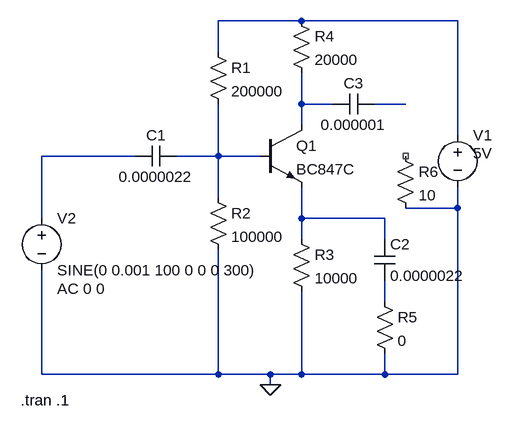
[diagram p0: schematic Wechselspannungsverstärker.asc]
Wechselspannungsverstärker.asc, the LTspice schematic file:
Version 4
SHEET 1 880 680
WIRE 224 -304 96 -304
WIRE 464 -304 224 -304
WIRE 96 -256 96 -304
WIRE 224 -176 224 -224
WIRE 272 -176 224 -176
WIRE 384 -176 336 -176
WIRE 224 -144 224 -176
WIRE 464 -128 464 -304
WIRE -32 -96 -176 -96
WIRE 96 -96 96 -176
WIRE 96 -96 32 -96
WIRE 160 -96 96 -96
WIRE 96 -32 96 -96
WIRE 464 -16 464 -48
WIRE 464 -16 384 -16
WIRE -176 0 -176 -96
WIRE 224 0 224 -48
WIRE 352 0 224 0
WIRE 224 32 224 0
WIRE 352 32 352 0
WIRE 352 128 352 96
WIRE -176 240 -176 80
WIRE 96 240 96 48
WIRE 96 240 -176 240
WIRE 176 240 96 240
WIRE 224 240 224 112
WIRE 224 240 176 240
WIRE 352 240 352 208
WIRE 352 240 224 240
WIRE 464 240 464 -16
WIRE 464 240 352 240
WIRE 176 256 176 240
FLAG 176 256 0
DATAFLAG 400 -304 ""
DATAFLAG 256 -176 ""
DATAFLAG 144 -96 ""
DATAFLAG 224 -32 ""
SYMBOL npn 160 -144 R0
SYMATTR InstName Q1
SYMATTR Value BC847C
SYMBOL res 80 -272 R0
SYMATTR InstName R1
SYMATTR Value 200000
SYMBOL res 80 -48 R0
SYMATTR InstName R2
SYMATTR Value 100000
SYMBOL res 208 16 R0
SYMATTR InstName R3
SYMATTR Value 10000
SYMBOL cap 32 -112 R90
WINDOW 0 0 32 VBottom 2
WINDOW 3 32 32 VTop 2
SYMATTR InstName C1
SYMATTR Value 0.0000022
SYMBOL voltage 464 -144 R0
WINDOW 3 24 44 Left 2
WINDOW 123 0 0 Left 0
WINDOW 39 0 0 Left 0
SYMATTR Value 5V
SYMATTR InstName V1
SYMBOL voltage -176 -16 R0
WINDOW 123 24 124 Left 2
WINDOW 39 0 0 Left 0
SYMATTR Value2 AC 0 0
SYMATTR InstName V2
SYMATTR Value SINE(0 0.001 100 0 0 0 300)
SYMBOL cap 336 -192 R90
WINDOW 0 0 32 VBottom 2
WINDOW 3 32 32 VTop 2
SYMATTR InstName C3
SYMATTR Value 0.000001
SYMBOL cap 336 32 R0
SYMATTR InstName C2
SYMATTR Value 0.0000022
SYMBOL res 208 -320 R0
SYMATTR InstName R4
SYMATTR Value 20000
SYMBOL res 336 112 R0
SYMATTR InstName R5
SYMATTR Value 0
SYMBOL res 368 -112 R0
SYMATTR InstName R6
SYMATTR Value 10
TEXT -208 280 Left 2 !.tran .1

The netlist it stands for:
* Wechselspannungsverstärker.asc
Q1 N002 N005 N006 0 BC847C
R1 N001 N005 200000
R2 N005 0 100000
R3 N006 0 10000
C1 N005 N004 0.0000022
V1 N001 0 5V
V2 N004 0 SINE(0 0.001 100 0 0 0 300) AC 0 0
C3 N003 N002 0.000001
C2 N006 N007 0.0000022
R4 N001 N002 20000
R5 N007 0 0
R6 NC_01 0 10
.model NPN NPN
.model PNP PNP
.lib standard.bjt
.tran .1
.backanno
.end